# Altium schematic sheet Sheet1.SchDoc
size A4
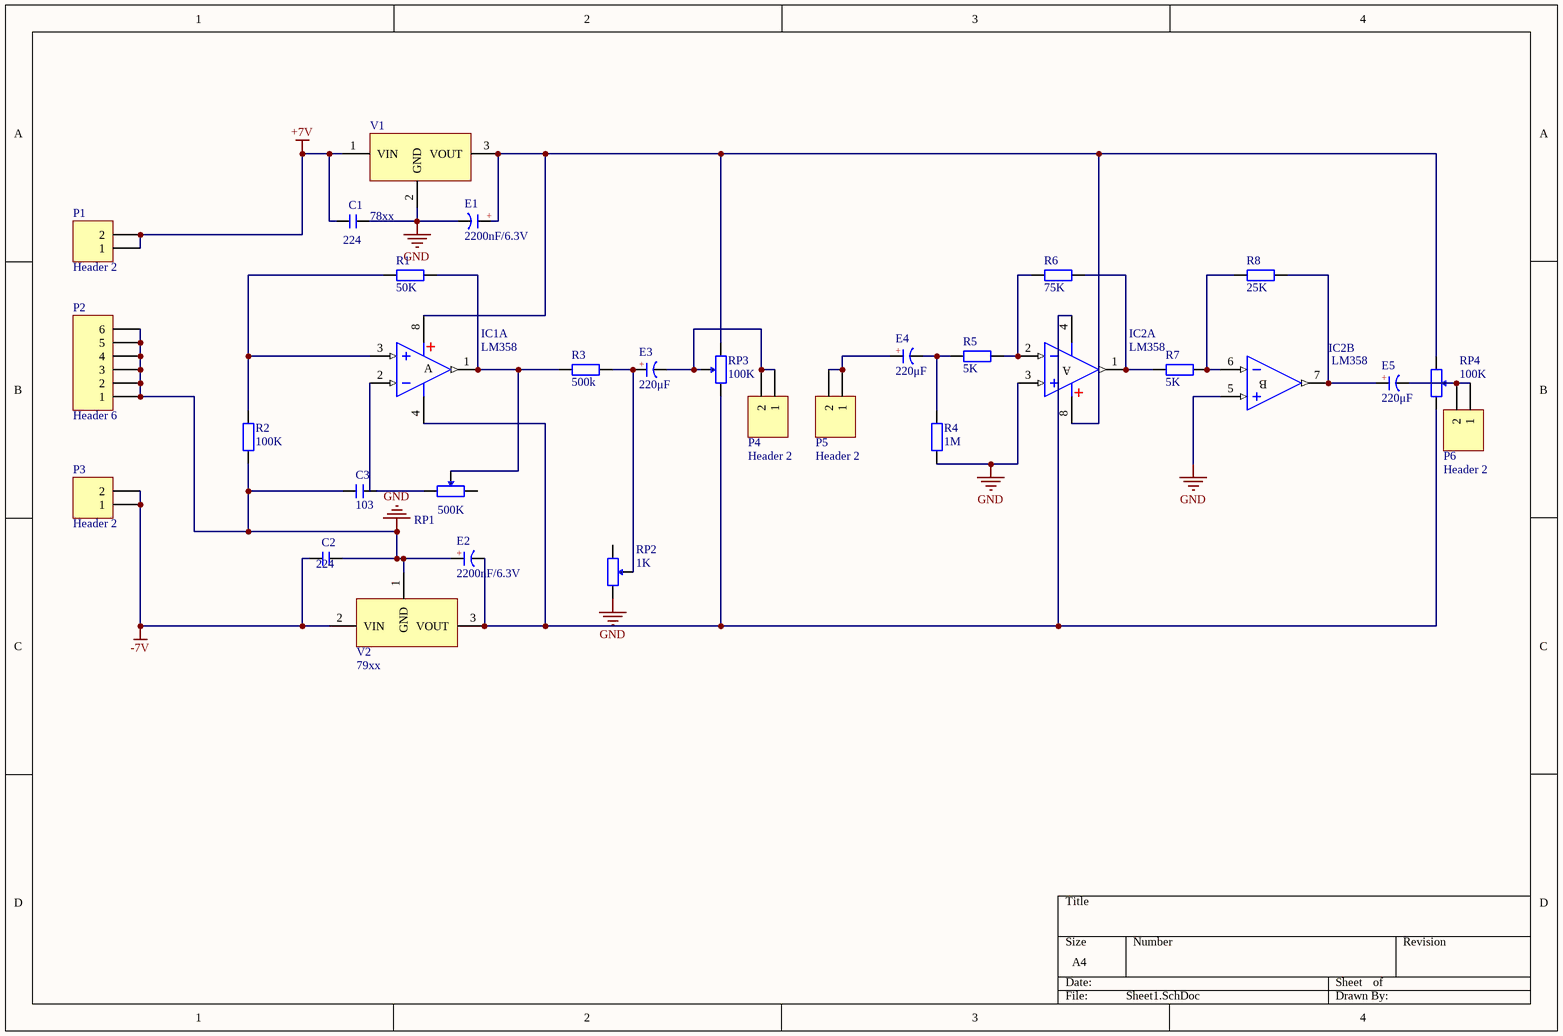
[diagram p0: Sheet1.SchDoc]

## Parts
C1  224  [C 0805_L]
C2  224  [C 0805_L]
C3  103  [C 0805_L]
E1  2200nF/6.3V  [CS 5.0*10*13 - C]
E2  2200nF/6.3V  [CS 5.0*10*13 - C]
E3  220μF  [CS 2.5*6.3*11 - C]
E4  220μF  [CS 2.0*5*8 - C]
E5  220μF  [CS 2.0*5*8 - C]
IC1  LM358  [SOP8_N]  (part A of 2)
IC2  LM358  [SOP8_N]  (parts A,B of 2)
P1  Header 2  [HDR1X2]
P2  Header 6  [HDR1X6]
P3  Header 2  [HDR1X2]
P4  Header 2  [HDR1X2]
P5  Header 2  [HDR1X2]
P6  Header 2  [HDR1X2]
R1  50K  [R 0805-HP_L]
R2  100K  [R 0805-HP_L]
R3  500k  [RS 1/4W]
R4  1M  [RS 1/4W]
R5  5K  [R 0805_L]
R6  75K  [R 0805_L]
R7  5K  [R 0805_L]
R8  25K  [R 0805_L]
RP1  500K  [3296W]
RP2  1K  [3296W]
RP3  100K  [3296W]
RP4  100K  [3296W]
V1  78xx  [TO220A]
V2  79xx  [TO220A]

## Nets
+7V: C1.1 P1.1 P1.2 V1.1(VIN)
-7V: C2.1 P3.1 P3.2 V2.2(VIN)
GND: C1.2 C2.2 C3.1 E1.2(K) E2.1(A) IC2.3(IN+) IC2.5(IN+) P2.1 P2.2 P2.3 P2.4 P2.5 P2.6 R2.1 R4.1 RP2.3 V1.2(GND) V2.1(GND)
NetC3_2: C3.2 RP1.1
NetE1_1: E1.1(A) IC1.8(V+) IC2.8(V+) RP3.3 RP4.1 V1.3(VOUT)
NetE2_2: E2.2(K) IC1.4(V-) IC2.4(V-) RP3.1 RP4.3 V2.3(VOUT)
NetE3_1: E3.1(A) R3.1 RP2.2
NetE3_2: E3.2(K) P4.1 P4.2 RP3.2
NetE4_1: E4.1(A) P5.1 P5.2
NetE4_2: E4.2(K) R4.2 R5.1
NetE5_1: E5.1(A) IC2.7(OUT) R8.2
NetE5_2: E5.2(K) P6.1 P6.2 RP4.2
NetIC1_1: IC1.1(OUT) R1.1 R3.2 RP1.2
NetIC1_3: IC1.3(IN+) R1.2 R2.2
NetIC2_1: IC2.1(OUT) R6.2 R7.1
NetIC2_2: IC2.2(IN-) R5.2 R6.1
NetIC2_6: IC2.6(IN-) R7.2 R8.1

Not connected (* = marked no-connect by the designer): IC1 2(IN-); RP1 3; RP2 1

## Notes on the sheet
- (in symbol C-CS) +
- (in symbol LM358, part A) A
- (in symbol LM358, part B) B

## Library data of the parts
C1-C3 = C: 无极性贴片电容; 版权归属: 源创客; BOM名称: 无极性贴片电容; 学习资源: www.ooocke.com
E1-E5 = C-CS: 直插固态电容; 版权归属: 源创客; BOM名称: 直插固态电容; 学习资源: www.ooocke.com
IC1 IC2 = LM358: 双路运放; 版权归属: 源创客; BOM名称: 双路运放; 学习资源: www.ooocke.com
P1 P3-P6 = Header 2: Header, 2-Pin; LatestRevisionDate: 17-Jul-2002; LatestRevisionNote: Re-released for DXP Platform.; Publisher: Altium Limited
P2 = Header 6: Header, 6-Pin; LatestRevisionDate: 17-Jul-2002; LatestRevisionNote: Re-released for DXP Platform.; Publisher: Altium Limited
R1 R2 = R-Precision: 精密贴片电阻; BOM名称: 精密电阻; 版权归属: 源创客; 学习资源: www.ooocke.com
R3 R4 = R-CRR: 直插色环电阻; BOM名称: 色环电阻; 版权归属: 源创客; 学习资源: www.ooocke.com
R5-R8 = R: 贴片电阻; 版权归属: 源创客; BOM名称: 贴片电阻; 学习资源: www.ooocke.com
RP1-RP4 = RP-ID: 插件单联电位器; BOM名称: 插件电位器; 版权归属: 源创客; 学习资源: www.ooocke.com
V1 = 78xx: 线性稳压芯片; 版权归属: 源创客; BOM名称: 线性稳压芯片; 学习资源: www.ooocke.com
V2 = 79xx: 线性稳压芯片; 版权归属: 源创客; BOM名称: 线性稳压芯片; 学习资源: www.ooocke.com